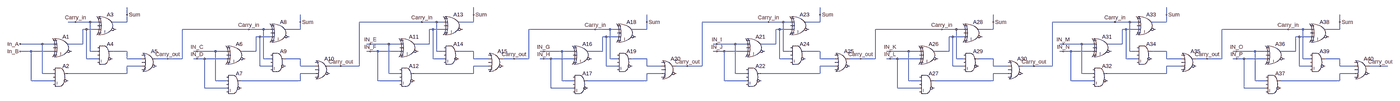
[diagram p0: schematic 8BITADDER.asc, whole sheet]
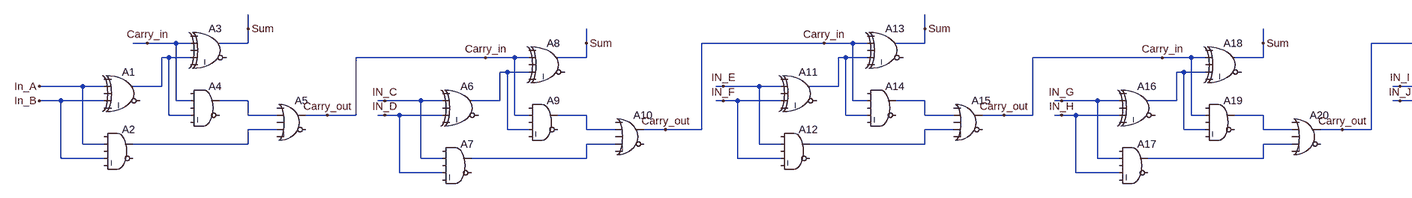
[diagram p1: schematic 8BITADDER.asc, part, row 1 of 1, column 1 of 2]
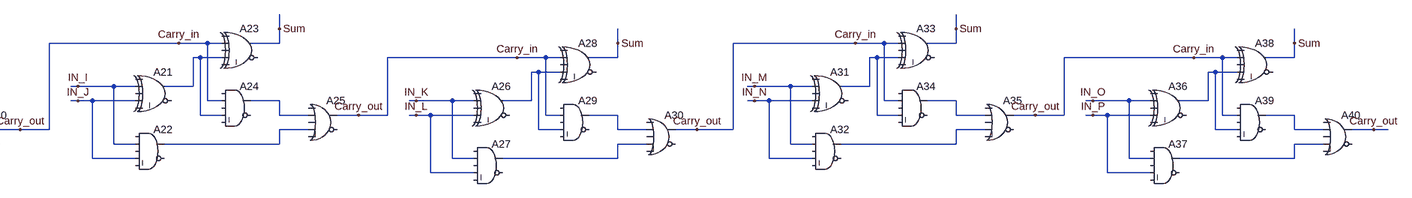
[diagram p2: schematic 8BITADDER.asc, part, row 1 of 1, column 2 of 2]
8BITADDER.asc, the LTspice schematic file:
Version 4
SHEET 1 5852 680
WIRE 336 -32 336 -64
WIRE 1840 -32 1840 -64
WIRE 3344 -32 3344 -64
WIRE 4848 -32 4848 -64
WIRE 112 0 80 0
WIRE 176 0 112 0
WIRE 208 0 176 0
WIRE 336 0 336 -32
WIRE 336 0 272 0
WIRE 1088 0 1088 -32
WIRE 1616 0 1344 0
WIRE 1680 0 1616 0
WIRE 1712 0 1680 0
WIRE 1840 0 1840 -32
WIRE 1840 0 1776 0
WIRE 2592 0 2592 -32
WIRE 3120 0 2832 0
WIRE 3184 0 3120 0
WIRE 3216 0 3184 0
WIRE 3344 0 3344 -32
WIRE 3344 0 3280 0
WIRE 4096 0 4096 -32
WIRE 4624 0 4352 0
WIRE 4688 0 4624 0
WIRE 4720 0 4688 0
WIRE 4848 0 4848 -32
WIRE 4848 0 4784 0
WIRE 5600 0 5600 -32
WIRE 160 32 144 32
WIRE 208 32 160 32
WIRE 864 32 576 32
WIRE 928 32 864 32
WIRE 960 32 928 32
WIRE 1088 32 1088 0
WIRE 1088 32 1024 32
WIRE 1664 32 1648 32
WIRE 1712 32 1664 32
WIRE 2368 32 2080 32
WIRE 2432 32 2368 32
WIRE 2464 32 2432 32
WIRE 2592 32 2592 0
WIRE 2592 32 2528 32
WIRE 3168 32 3152 32
WIRE 3216 32 3168 32
WIRE 3872 32 3584 32
WIRE 3936 32 3872 32
WIRE 3968 32 3936 32
WIRE 4096 32 4096 0
WIRE 4096 32 4032 32
WIRE 4672 32 4656 32
WIRE 4720 32 4672 32
WIRE 5376 32 5088 32
WIRE 5440 32 5376 32
WIRE 5472 32 5440 32
WIRE 5600 32 5600 0
WIRE 5600 32 5536 32
WIRE 912 64 896 64
WIRE 960 64 912 64
WIRE 2416 64 2400 64
WIRE 2464 64 2416 64
WIRE 3920 64 3904 64
WIRE 3968 64 3920 64
WIRE 5424 64 5408 64
WIRE 5472 64 5424 64
WIRE -32 96 -128 96
WIRE 16 96 -32 96
WIRE 144 96 144 32
WIRE 144 96 80 96
WIRE 1392 96 1376 96
WIRE 1472 96 1392 96
WIRE 1520 96 1472 96
WIRE 1648 96 1648 32
WIRE 1648 96 1584 96
WIRE 2896 96 2880 96
WIRE 2976 96 2896 96
WIRE 3024 96 2976 96
WIRE 3152 96 3152 32
WIRE 3152 96 3088 96
WIRE 4400 96 4384 96
WIRE 4480 96 4400 96
WIRE 4528 96 4480 96
WIRE 4656 96 4656 32
WIRE 4656 96 4592 96
WIRE -80 128 -128 128
WIRE 16 128 -80 128
WIRE 176 128 176 0
WIRE 208 128 176 128
WIRE 336 128 272 128
WIRE 640 128 624 128
WIRE 720 128 640 128
WIRE 768 128 720 128
WIRE 896 128 896 64
WIRE 896 128 832 128
WIRE 1392 128 1376 128
WIRE 1424 128 1392 128
WIRE 1520 128 1424 128
WIRE 1680 128 1680 0
WIRE 1712 128 1680 128
WIRE 1840 128 1776 128
WIRE 2144 128 2128 128
WIRE 2224 128 2144 128
WIRE 2272 128 2224 128
WIRE 2400 128 2400 64
WIRE 2400 128 2336 128
WIRE 2896 128 2880 128
WIRE 2928 128 2896 128
WIRE 3024 128 2928 128
WIRE 3184 128 3184 0
WIRE 3216 128 3184 128
WIRE 3344 128 3280 128
WIRE 3648 128 3632 128
WIRE 3728 128 3648 128
WIRE 3776 128 3728 128
WIRE 3904 128 3904 64
WIRE 3904 128 3840 128
WIRE 4400 128 4384 128
WIRE 4432 128 4400 128
WIRE 4528 128 4432 128
WIRE 4688 128 4688 0
WIRE 4720 128 4688 128
WIRE 4848 128 4784 128
WIRE 5152 128 5136 128
WIRE 5232 128 5152 128
WIRE 5280 128 5232 128
WIRE 5408 128 5408 64
WIRE 5408 128 5344 128
WIRE 160 160 160 32
WIRE 208 160 160 160
WIRE 336 160 336 128
WIRE 400 160 336 160
WIRE 512 160 464 160
WIRE 576 160 576 32
WIRE 576 160 512 160
WIRE 640 160 624 160
WIRE 672 160 640 160
WIRE 768 160 672 160
WIRE 928 160 928 32
WIRE 960 160 928 160
WIRE 1088 160 1024 160
WIRE 1664 160 1664 32
WIRE 1712 160 1664 160
WIRE 1840 160 1840 128
WIRE 1904 160 1840 160
WIRE 2016 160 1968 160
WIRE 2080 160 2080 32
WIRE 2080 160 2016 160
WIRE 2144 160 2128 160
WIRE 2176 160 2144 160
WIRE 2272 160 2176 160
WIRE 2432 160 2432 32
WIRE 2464 160 2432 160
WIRE 2592 160 2528 160
WIRE 3168 160 3168 32
WIRE 3216 160 3168 160
WIRE 3344 160 3344 128
WIRE 3408 160 3344 160
WIRE 3520 160 3472 160
WIRE 3584 160 3584 32
WIRE 3584 160 3520 160
WIRE 3648 160 3632 160
WIRE 3680 160 3648 160
WIRE 3776 160 3680 160
WIRE 3936 160 3936 32
WIRE 3968 160 3936 160
WIRE 4096 160 4032 160
WIRE 4672 160 4672 32
WIRE 4720 160 4672 160
WIRE 4848 160 4848 128
WIRE 4912 160 4848 160
WIRE 5024 160 4976 160
WIRE 5088 160 5088 32
WIRE 5088 160 5024 160
WIRE 5152 160 5136 160
WIRE 5184 160 5152 160
WIRE 5280 160 5184 160
WIRE 5440 160 5440 32
WIRE 5472 160 5440 160
WIRE 5600 160 5536 160
WIRE 400 192 336 192
WIRE 912 192 912 64
WIRE 960 192 912 192
WIRE 1088 192 1088 160
WIRE 1152 192 1088 192
WIRE 1264 192 1216 192
WIRE 1344 192 1344 0
WIRE 1344 192 1264 192
WIRE 1904 192 1840 192
WIRE 2416 192 2416 64
WIRE 2464 192 2416 192
WIRE 2592 192 2592 160
WIRE 2656 192 2592 192
WIRE 2768 192 2720 192
WIRE 2832 192 2832 0
WIRE 2832 192 2768 192
WIRE 3408 192 3344 192
WIRE 3920 192 3920 64
WIRE 3968 192 3920 192
WIRE 4096 192 4096 160
WIRE 4160 192 4096 192
WIRE 4272 192 4224 192
WIRE 4352 192 4352 0
WIRE 4352 192 4272 192
WIRE 4912 192 4848 192
WIRE 5424 192 5424 64
WIRE 5472 192 5424 192
WIRE 5600 192 5600 160
WIRE 5664 192 5600 192
WIRE 5776 192 5728 192
WIRE 5808 192 5776 192
WIRE -32 224 -32 96
WIRE 16 224 -32 224
WIRE 336 224 336 192
WIRE 336 224 80 224
WIRE 1152 224 1088 224
WIRE 1472 224 1472 96
WIRE 1520 224 1472 224
WIRE 1840 224 1840 192
WIRE 1840 224 1584 224
WIRE 2656 224 2592 224
WIRE 2976 224 2976 96
WIRE 3024 224 2976 224
WIRE 3344 224 3344 192
WIRE 3344 224 3088 224
WIRE 4160 224 4096 224
WIRE 4480 224 4480 96
WIRE 4528 224 4480 224
WIRE 4848 224 4848 192
WIRE 4848 224 4592 224
WIRE 5664 224 5600 224
WIRE -80 256 -80 128
WIRE 16 256 -80 256
WIRE 720 256 720 128
WIRE 768 256 720 256
WIRE 1088 256 1088 224
WIRE 1088 256 832 256
WIRE 1424 256 1424 128
WIRE 1520 256 1424 256
WIRE 2224 256 2224 128
WIRE 2272 256 2224 256
WIRE 2592 256 2592 224
WIRE 2592 256 2336 256
WIRE 2928 256 2928 128
WIRE 3024 256 2928 256
WIRE 3728 256 3728 128
WIRE 3776 256 3728 256
WIRE 4096 256 4096 224
WIRE 4096 256 3840 256
WIRE 4432 256 4432 128
WIRE 4528 256 4432 256
WIRE 5232 256 5232 128
WIRE 5280 256 5232 256
WIRE 5600 256 5600 224
WIRE 5600 256 5344 256
WIRE 672 288 672 160
WIRE 768 288 672 288
WIRE 2176 288 2176 160
WIRE 2272 288 2176 288
WIRE 3680 288 3680 160
WIRE 3776 288 3680 288
WIRE 5184 288 5184 160
WIRE 5280 288 5184 288
FLAG 112 0 Carry_in
FLAG 512 160 Carry_out
FLAG 336 -32 Sum
FLAG 864 32 Carry_in
FLAG 1264 192 Carry_out
FLAG 1088 0 Sum
FLAG 1616 0 Carry_in
FLAG 2016 160 Carry_out
FLAG 1840 -32 Sum
FLAG 2368 32 Carry_in
FLAG 2768 192 Carry_out
FLAG 2592 0 Sum
FLAG 3120 0 Carry_in
FLAG 3520 160 Carry_out
FLAG 3344 -32 Sum
FLAG 3872 32 Carry_in
FLAG 4272 192 Carry_out
FLAG 4096 0 Sum
FLAG 4624 0 Carry_in
FLAG 5024 160 Carry_out
FLAG 4848 -32 Sum
FLAG 5376 32 Carry_in
FLAG 5776 192 Carry_out
FLAG 5600 0 Sum
FLAG -128 96 In_A
FLAG -128 128 In_B
FLAG 640 128 IN_C
FLAG 640 160 IN_D
FLAG 1392 96 IN_E
FLAG 1392 128 IN_F
FLAG 2144 128 IN_G
FLAG 2144 160 IN_H
FLAG 2896 96 IN_I
FLAG 2896 128 IN_J
FLAG 3648 128 IN_K
FLAG 3648 160 IN_L
FLAG 4400 96 IN_M
FLAG 4400 128 IN_N
FLAG 5152 128 IN_O
FLAG 5152 160 IN_P
SYMBOL Digital\\xor 64 48 R0
SYMATTR InstName A1
SYMBOL Digital\\and 48 176 R0
SYMATTR InstName A2
SYMBOL Digital\\xor 256 -48 R0
SYMATTR InstName A3
SYMBOL Digital\\and 240 80 R0
SYMATTR InstName A4
SYMBOL Digital\\or 432 112 R0
SYMATTR InstName A5
SYMBOL Digital\\xor 816 80 R0
SYMATTR InstName A6
SYMBOL Digital\\and 800 208 R0
SYMATTR InstName A7
SYMBOL Digital\\xor 1008 -16 R0
SYMATTR InstName A8
SYMBOL Digital\\and 992 112 R0
SYMATTR InstName A9
SYMBOL Digital\\or 1184 144 R0
SYMATTR InstName A10
SYMBOL Digital\\xor 1568 48 R0
SYMATTR InstName A11
SYMBOL Digital\\and 1552 176 R0
SYMATTR InstName A12
SYMBOL Digital\\xor 1760 -48 R0
SYMATTR InstName A13
SYMBOL Digital\\and 1744 80 R0
SYMATTR InstName A14
SYMBOL Digital\\or 1936 112 R0
SYMATTR InstName A15
SYMBOL Digital\\xor 2320 80 R0
SYMATTR InstName A16
SYMBOL Digital\\and 2304 208 R0
SYMATTR InstName A17
SYMBOL Digital\\xor 2512 -16 R0
SYMATTR InstName A18
SYMBOL Digital\\and 2496 112 R0
SYMATTR InstName A19
SYMBOL Digital\\or 2688 144 R0
SYMATTR InstName A20
SYMBOL Digital\\xor 3072 48 R0
SYMATTR InstName A21
SYMBOL Digital\\and 3056 176 R0
SYMATTR InstName A22
SYMBOL Digital\\xor 3264 -48 R0
SYMATTR InstName A23
SYMBOL Digital\\and 3248 80 R0
SYMATTR InstName A24
SYMBOL Digital\\or 3440 112 R0
SYMATTR InstName A25
SYMBOL Digital\\xor 3824 80 R0
SYMATTR InstName A26
SYMBOL Digital\\and 3808 208 R0
SYMATTR InstName A27
SYMBOL Digital\\xor 4016 -16 R0
SYMATTR InstName A28
SYMBOL Digital\\and 4000 112 R0
SYMATTR InstName A29
SYMBOL Digital\\or 4192 144 R0
SYMATTR InstName A30
SYMBOL Digital\\xor 4576 48 R0
SYMATTR InstName A31
SYMBOL Digital\\and 4560 176 R0
SYMATTR InstName A32
SYMBOL Digital\\xor 4768 -48 R0
SYMATTR InstName A33
SYMBOL Digital\\and 4752 80 R0
SYMATTR InstName A34
SYMBOL Digital\\or 4944 112 R0
SYMATTR InstName A35
SYMBOL Digital\\xor 5328 80 R0
SYMATTR InstName A36
SYMBOL Digital\\and 5312 208 R0
SYMATTR InstName A37
SYMBOL Digital\\xor 5520 -16 R0
SYMATTR InstName A38
SYMBOL Digital\\and 5504 112 R0
SYMATTR InstName A39
SYMBOL Digital\\or 5696 144 R0
SYMATTR InstName A40

The netlist it stands for:
* 8BITADDER.asc
A1 0 In_A 0 In_B 0 0 N001 0 XOR
A2 0 In_A 0 In_B 0 0 N017 0 AND
A3 0 Carry_out 0 N001 0 0 Sum 0 XOR
A4 0 Carry_out 0 N001 0 0 N009 0 AND
A5 0 N009 0 N017 0 0 Carry_out 0 OR
A6 0 IN_C 0 IN_D 0 0 N005 0 XOR
A7 0 IN_C 0 IN_D 0 0 N021 0 AND
A8 0 Carry_out 0 N005 0 0 Sum 0 XOR
A9 0 Carry_out 0 N005 0 0 N013 0 AND
A10 0 N013 0 N021 0 0 Carry_out 0 OR
A11 0 IN_E 0 IN_F 0 0 N002 0 XOR
A12 0 IN_E 0 IN_F 0 0 N018 0 AND
A13 0 Carry_out 0 N002 0 0 Sum 0 XOR
A14 0 Carry_out 0 N002 0 0 N010 0 AND
A15 0 N010 0 N018 0 0 Carry_out 0 OR
A16 0 IN_G 0 IN_H 0 0 N006 0 XOR
A17 0 IN_G 0 IN_H 0 0 N022 0 AND
A18 0 Carry_out 0 N006 0 0 Sum 0 XOR
A19 0 Carry_out 0 N006 0 0 N014 0 AND
A20 0 N014 0 N022 0 0 Carry_out 0 OR
A21 0 IN_I 0 IN_J 0 0 N003 0 XOR
A22 0 IN_I 0 IN_J 0 0 N019 0 AND
A23 0 Carry_out 0 N003 0 0 Sum 0 XOR
A24 0 Carry_out 0 N003 0 0 N011 0 AND
A25 0 N011 0 N019 0 0 Carry_out 0 OR
A26 0 IN_K 0 IN_L 0 0 N007 0 XOR
A27 0 IN_K 0 IN_L 0 0 N023 0 AND
A28 0 Carry_out 0 N007 0 0 Sum 0 XOR
A29 0 Carry_out 0 N007 0 0 N015 0 AND
A30 0 N015 0 N023 0 0 Carry_out 0 OR
A31 0 IN_M 0 IN_N 0 0 N004 0 XOR
A32 0 IN_M 0 IN_N 0 0 N020 0 AND
A33 0 Carry_out 0 N004 0 0 Sum 0 XOR
A34 0 Carry_out 0 N004 0 0 N012 0 AND
A35 0 N012 0 N020 0 0 Carry_out 0 OR
A36 0 IN_O 0 IN_P 0 0 N008 0 XOR
A37 0 IN_O 0 IN_P 0 0 N024 0 AND
A38 0 Carry_out 0 N008 0 0 Sum 0 XOR
A39 0 Carry_out 0 N008 0 0 N016 0 AND
A40 0 N016 0 N024 0 0 Carry_out 0 OR
.backanno
.end